# Altium schematic sheet TOP.SchDoc
size A4
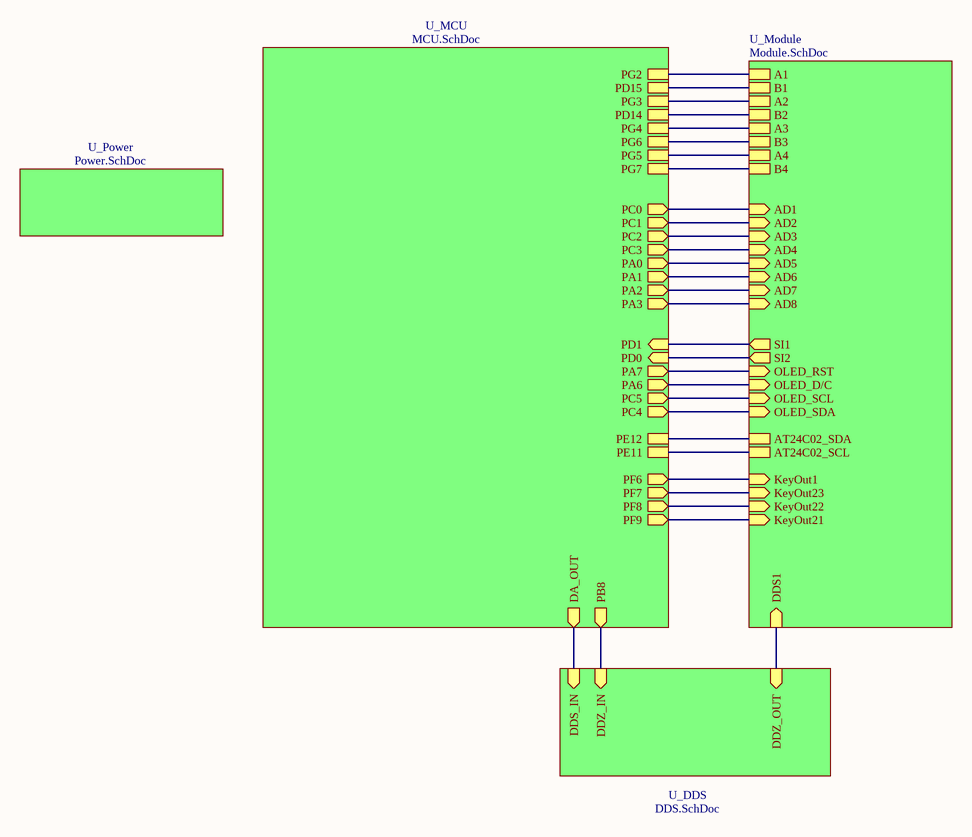
[diagram p0: TOP.SchDoc]

## Sub-sheets
U_DDS = DDS.SchDoc: DDS_IN (in), DDZ_OUT (in), DDZ_IN (in)
U_MCU = MCU.SchDoc: PG3, PG4, PG2, PG5, PD15, PD14, PG6, PG7, PA2 (out), PA3 (out), PA7 (out), PA6 (out), PC4 (out), PC5 (out), PA0 (out), PA1 (out), PD1 (in), PB8 (out), DA_OUT (out), PC3 (out), PC2 (out), PC1 (out), PC0 (out), PE12, PE11, PD0 (in), PF6 (out), PF7 (out), PF8 (out), PF9 (out)
U_Module = Module.SchDoc: AT24C02_SCL, AT24C02_SDA, A1, B1, OLED_D/C (in), OLED_RST (in), OLED_SDA (in), OLED_SCL (in), DDS1 (in), A2, B2, A3, B3, A4, B4, SI1 (out), AD1 (in), AD2 (in), AD3 (in), AD4 (in), AD5 (in), AD6 (in), AD7 (in), AD8 (in), SI2 (out), KeyOut1 (in), KeyOut21 (in), KeyOut22 (in), KeyOut23 (in)
U_Power = Power.SchDoc: no entries

## Nets
(unnamed): sheet U_Module/AT24C02_SCL, sheet U_MCU/PE11
(unnamed): sheet U_Module/AT24C02_SDA, sheet U_MCU/PE12
(unnamed): sheet U_Module/A1, sheet U_MCU/PG2
(unnamed): sheet U_Module/B1, sheet U_MCU/PD15
(unnamed): sheet U_Module/OLED_D/C, sheet U_MCU/PA6
(unnamed): sheet U_Module/OLED_RST, sheet U_MCU/PA7
(unnamed): sheet U_Module/OLED_SDA, sheet U_MCU/PC4
(unnamed): sheet U_Module/OLED_SCL, sheet U_MCU/PC5
(unnamed): sheet U_Module/DDS1, sheet U_DDS/DDZ_OUT
(unnamed): sheet U_Module/A2, sheet U_MCU/PG3
(unnamed): sheet U_Module/B2, sheet U_MCU/PD14
(unnamed): sheet U_Module/A3, sheet U_MCU/PG4
(unnamed): sheet U_Module/B3, sheet U_MCU/PG6
(unnamed): sheet U_Module/A4, sheet U_MCU/PG5
(unnamed): sheet U_Module/B4, sheet U_MCU/PG7
(unnamed): sheet U_Module/SI1, sheet U_MCU/PD1
(unnamed): sheet U_Module/AD1, sheet U_MCU/PC0
(unnamed): sheet U_Module/AD2, sheet U_MCU/PC1
(unnamed): sheet U_Module/AD3, sheet U_MCU/PC2
(unnamed): sheet U_Module/AD4, sheet U_MCU/PC3
(unnamed): sheet U_Module/AD5, sheet U_MCU/PA0
(unnamed): sheet U_Module/AD6, sheet U_MCU/PA1
(unnamed): sheet U_Module/AD7, sheet U_MCU/PA2
(unnamed): sheet U_Module/AD8, sheet U_MCU/PA3
(unnamed): sheet U_Module/SI2, sheet U_MCU/PD0
(unnamed): sheet U_Module/KeyOut1, sheet U_MCU/PF6
(unnamed): sheet U_Module/KeyOut21, sheet U_MCU/PF9
(unnamed): sheet U_Module/KeyOut22, sheet U_MCU/PF8
(unnamed): sheet U_Module/KeyOut23, sheet U_MCU/PF7
(unnamed): sheet U_MCU/PB8, sheet U_DDS/DDZ_IN
(unnamed): sheet U_MCU/DA_OUT, sheet U_DDS/DDS_IN